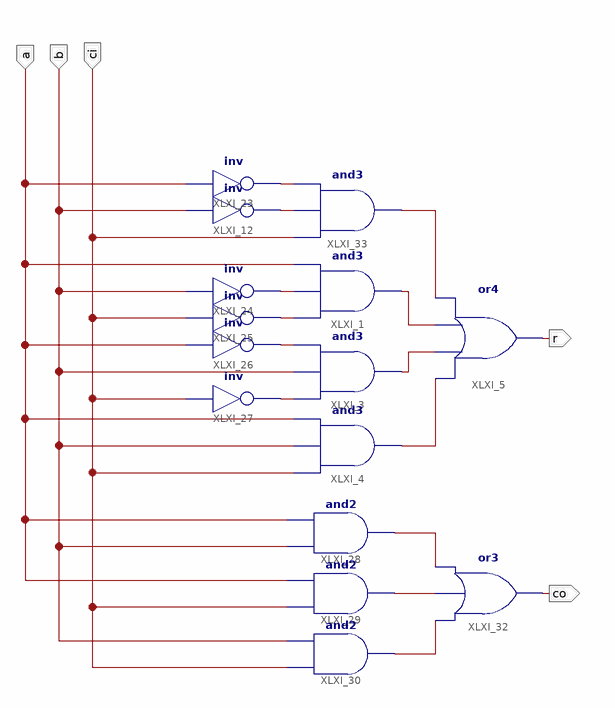
[diagram p0: schematic sheet 1]
// Xilinx ISE schematic add1b.sch (spartan3e) as structural Verilog: 15 symbols, 5 ports
module add1b (
  input  b,
  input  ci,
  input  a,
  output r,
  output co
);

  wire XLXN_3, XLXN_4, XLXN_5, XLXN_6, XLXN_44, XLXN_45, XLXN_62, XLXN_78, XLXN_91, XLXN_92, XLXN_93,
       XLXN_121, XLXN_122;

  not XLXI_12 (XLXN_122, b);
  and XLXI_1 (XLXN_4, XLXN_45, XLXN_44, a);
  and XLXI_3 (XLXN_5, XLXN_62, b, XLXN_78);
  and XLXI_4 (XLXN_6, ci, b, a);
  or XLXI_5 (r, XLXN_6, XLXN_5, XLXN_4, XLXN_3);
  not XLXI_23 (XLXN_121, a);
  not XLXI_24 (XLXN_44, b);
  not XLXI_25 (XLXN_45, ci);
  not XLXI_26 (XLXN_78, a);
  not XLXI_27 (XLXN_62, ci);
  and XLXI_28 (XLXN_91, b, a);
  and XLXI_29 (XLXN_92, ci, a);
  and XLXI_30 (XLXN_93, ci, b);
  or XLXI_32 (co, XLXN_93, XLXN_92, XLXN_91);
  and XLXI_33 (XLXN_3, ci, XLXN_122, XLXN_121);
endmodule
